# Altium schematic sheet EPS_Connectors.SchDoc: Connectors
size A3
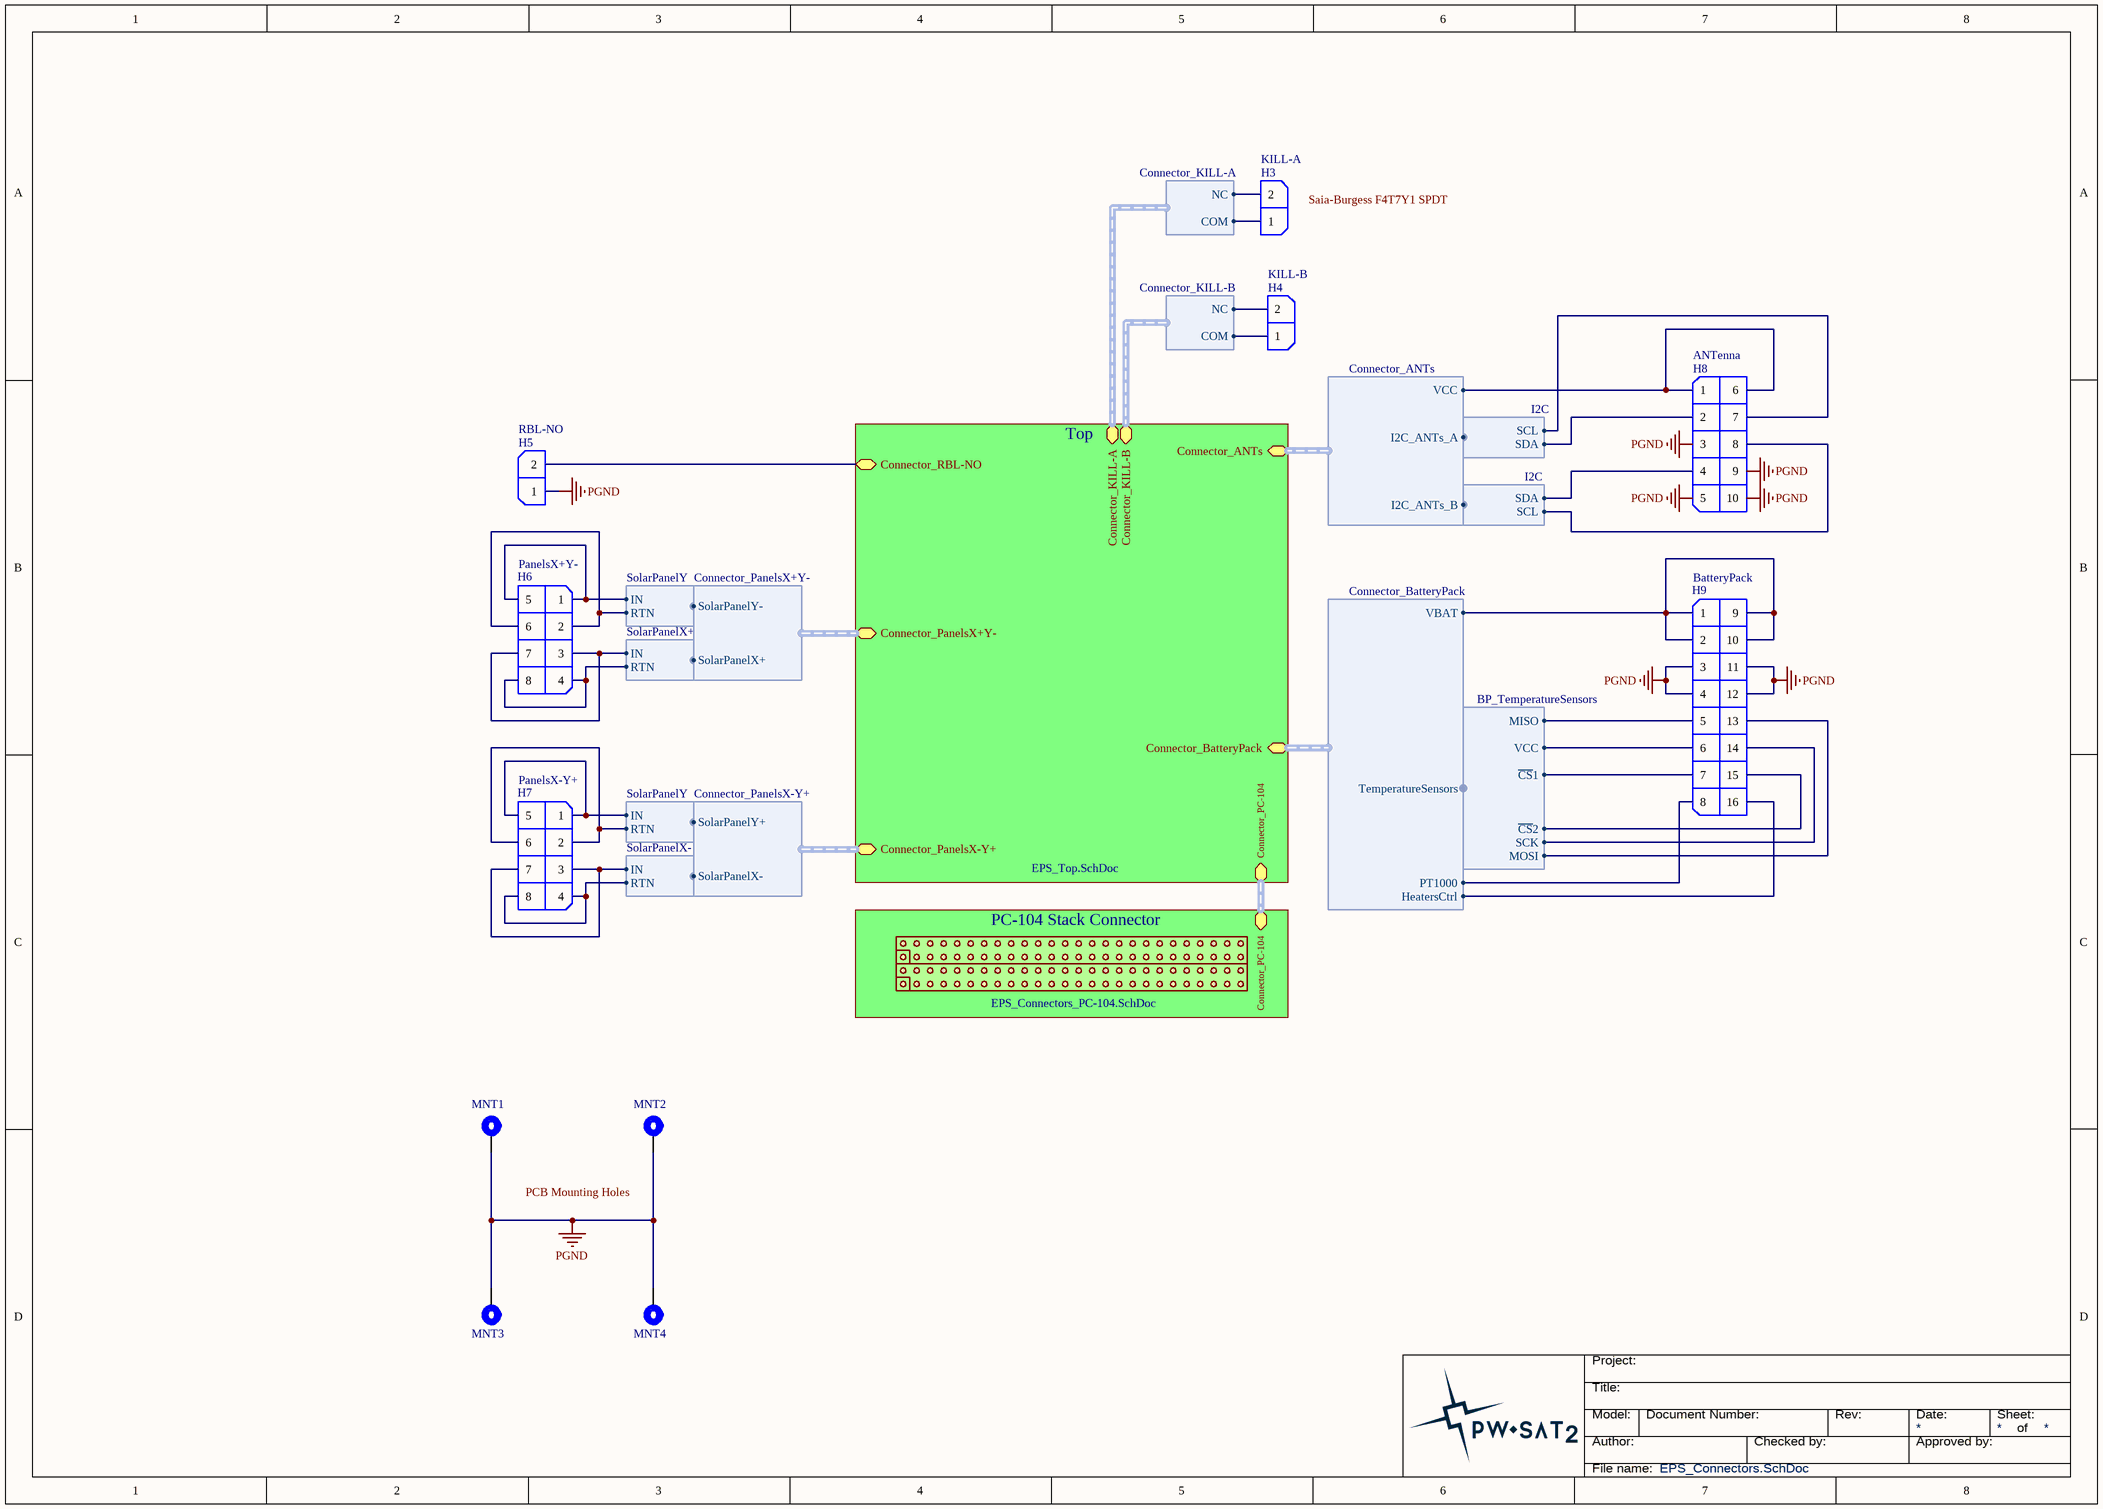
[diagram p0: EPS_Connectors.SchDoc]

## Parts
H3  KILL-A  [Harwin_Datamate_L-Tek_M80-8770222]
H4  KILL-B  [Harwin_Datamate_L-Tek_M80-8770222]
H5  RBL-NO  [Harwin_Datamate_L-Tek_M80-8770222]
H6  PanelsX+Y-  [Harwin_Datamate_L-Tek_M80-8670805]
H7  PanelsX-Y+  [Harwin_Datamate_L-Tek_M80-8670805]
H8  ANTenna  [Harwin_Datamate_L-Tek_M80-8671005]
H9  BatteryPack  [Harwin_Datamate_L-Tek_M80-8531642]
MNT1  Mounting Hole  [PC-104_PcbMntHole_M3]  (value not drawn)
MNT2  Mounting Hole  [PC-104_PcbMntHole_M3]  (value not drawn)
MNT3  Mounting Hole  [PC-104_PcbMntHole_M3]  (value not drawn)
MNT4  Mounting Hole  [PC-104_PcbMntHole_M3]  (value not drawn)

## Sub-sheets
PC-104 Stack Connector = EPS_Connectors_PC-104.SchDoc: Connector_PC-104 (harness Connector_PC-104)
Top = EPS_Top.SchDoc: Connector_PC-104 (harness Connector_PC-104), Connector_KILL-B (harness Connector_KILL-B), Connector_KILL-A (harness Connector_KILL-A), Connector_PanelsX+Y- (harness Connector_PanelsX+Y-), Connector_PanelsX-Y+ (harness Connector_PanelsX-Y+), Connector_ANTs (harness Connector_ANTs), Connector_BatteryPack (harness Connector_BatteryPack), Connector_RBL-NO (bidir)

## Harnesses
SolarPanelX-: IN, RTN
SolarPanelY: IN, RTN
SolarPanelX+: IN, RTN
Connector_PanelsX-Y+: SolarPanelX-, SolarPanelY+
Connector_PanelsX+Y-: SolarPanelX+, SolarPanelY-
Connector_KILL-A: COM, NC
Connector_KILL-B: COM, NC
I2C: SDA, SCL
Connector_ANTs: I2C_ANTs_A, VCC, I2C_ANTs_B
Connector_BatteryPack: VBAT, TemperatureSensors, HeatersCtrl, PT1000
BP_TemperatureSensors: MISO, VCC, ~{CS}1, ~{CS}2, SCK, MOSI

## Nets
PGND: H5.1 H8.3 H8.5 H8.9 H8.10 H9.3 H9.4 H9.11 H9.12 MNT1.1 MNT2.1 MNT3.1 MNT4.1
NetH3_1: H3.1 ; sheet Top/Connector_KILL-A.COM
NetH3_2: H3.2 ; sheet Top/Connector_KILL-A.NC
NetH4_1: H4.1 ; sheet Top/Connector_KILL-B.COM
NetH4_2: H4.2 ; sheet Top/Connector_KILL-B.NC
NetH5_2: H5.2 ; sheet Top/Connector_RBL-NO
NetH6_1: H6.1 H6.5 ; harness SolarPanelY.IN
NetH6_2: H6.2 H6.6 ; harness SolarPanelY.RTN
NetH6_3: H6.3 H6.7 ; harness SolarPanelX+.IN
NetH6_4: H6.4 H6.8 ; harness SolarPanelX+.RTN
NetH7_1: H7.1 H7.5 ; harness SolarPanelY.IN
NetH7_2: H7.2 H7.6 ; harness SolarPanelY.RTN
NetH7_3: H7.3 H7.7 ; harness SolarPanelX-.IN
NetH7_4: H7.4 H7.8 ; harness SolarPanelX-.RTN
NetH8_1: H8.1 H8.6 ; sheet Top/Connector_ANTs.VCC
NetH8_2: H8.2 ; harness I2C.SDA
NetH8_4: H8.4 ; harness I2C.SDA
NetH8_7: H8.7 ; harness I2C.SCL
NetH8_8: H8.8 ; harness I2C.SCL
NetH9_1: H9.1 H9.2 H9.9 H9.10 ; sheet Top/Connector_BatteryPack.VBAT
NetH9_5: H9.5 ; harness BP_TemperatureSensors.MISO
NetH9_6: H9.6 ; harness BP_TemperatureSensors.VCC
NetH9_7: H9.7 ; harness BP_TemperatureSensors.~{CS}1
NetH9_8: H9.8 ; sheet Top/Connector_BatteryPack.PT1000
NetH9_13: H9.13 ; harness BP_TemperatureSensors.MOSI
NetH9_14: H9.14 ; harness BP_TemperatureSensors.SCK
NetH9_15: H9.15 ; harness BP_TemperatureSensors.~{CS}2
NetH9_16: H9.16 ; sheet Top/Connector_BatteryPack.HeatersCtrl

## Buses and harness runs
harness sheet PC-104 Stack Connector/Connector_PC-104 = sheet Top/Connector_PC-104

## Notes on the sheet
- (near H3) Saia-Burgess F4T7Y1 SPDT
- PCB Mounting Holes
- Title:
- Project:
- Author:
- Model:
- Document Number:
- Checked by:
- Rev:
- Date:
- Approved by:
- Sheet:
- of
- File name:

## Library data of the parts
H3-H5 = Harwin_Datamate_L-Tek_1x2pin: Harwin DataMate L-Tek, 2mm pitch, 1x2pin.; Value: Harwin DataMate L-Tek 1x2pin
H6 H7 = Harwin_Datamate_L-Tek_2x4pin: Harwin DataMate L-Tek, 2mm pitch, 2x4pin.; Value: Harwin DataMate L-Tek 2x4pin
H8 = Harwin_Datamate_L-Tek_2x5pin: Harwin DataMate L-Tek, 2mm pitch, 2x5pin.; Value: Harwin DataMate L-Tek 2x5pin
H9 = Harwin_Datamate_L-Tek_2x8pin: Harwin DataMate L-Tek, 2mm pitch, 2x8pin.; Value: BatteryPack
MNT1-MNT4 = MntHole: PCB Mounting Hole; Value: Mounting Hole